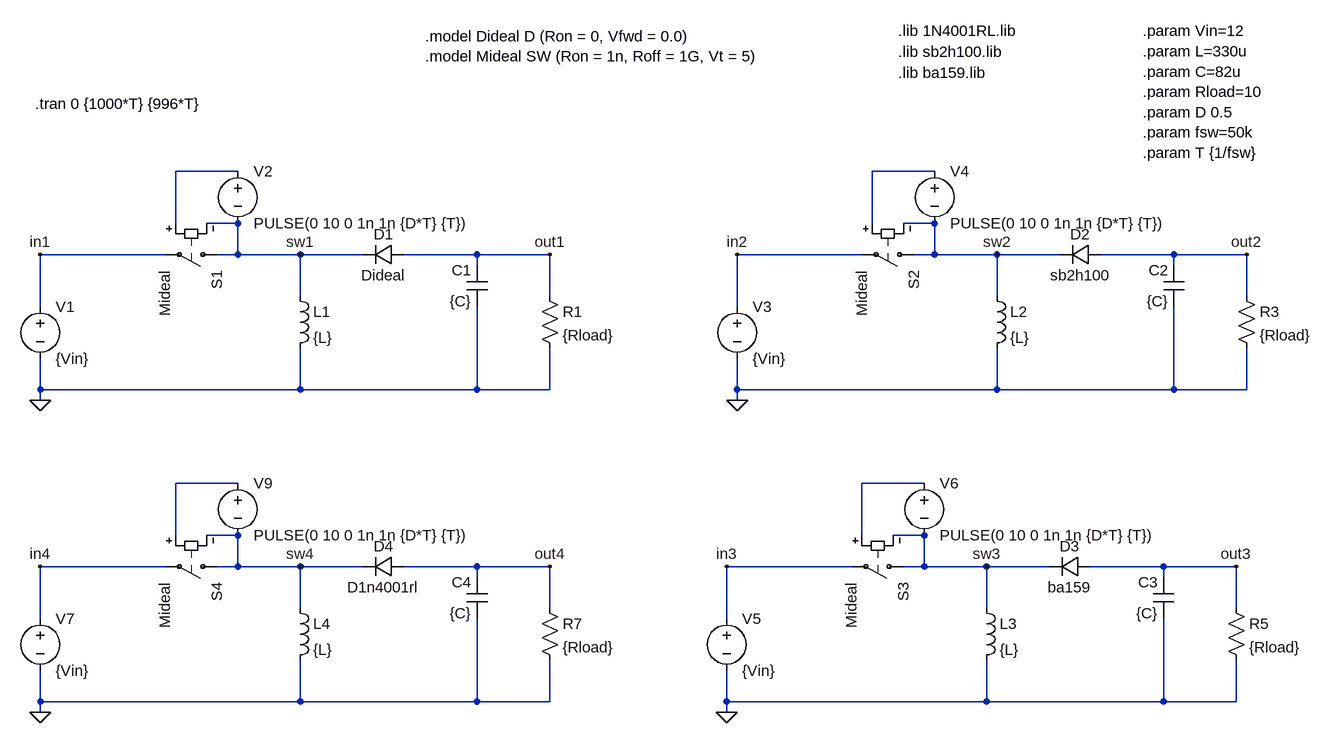
[diagram p0: schematic buckBoostRealDiode.asc]
buckBoostRealDiode.asc, the LTspice schematic file:
Version 4
SHEET 1 2852 1772
WIRE 320 -48 224 -48
WIRE 1392 -48 1296 -48
WIRE 224 32 224 -48
WIRE 320 32 272 32
WIRE 1296 32 1296 -48
WIRE 1392 32 1344 32
WIRE 208 80 16 80
WIRE 320 80 320 32
WIRE 320 80 288 80
WIRE 416 80 320 80
WIRE 512 80 416 80
WIRE 688 80 576 80
WIRE 800 80 688 80
WIRE 1280 80 1088 80
WIRE 1392 80 1392 32
WIRE 1392 80 1360 80
WIRE 1488 80 1392 80
WIRE 1584 80 1488 80
WIRE 1760 80 1648 80
WIRE 1872 80 1760 80
WIRE 688 96 688 80
WIRE 1760 96 1760 80
WIRE 416 144 416 80
WIRE 800 144 800 80
WIRE 1488 144 1488 80
WIRE 1872 144 1872 80
WIRE 16 160 16 80
WIRE 1088 160 1088 80
WIRE 16 288 16 240
WIRE 416 288 416 224
WIRE 416 288 16 288
WIRE 688 288 688 160
WIRE 688 288 416 288
WIRE 800 288 800 224
WIRE 800 288 688 288
WIRE 1088 288 1088 240
WIRE 1488 288 1488 224
WIRE 1488 288 1088 288
WIRE 1760 288 1760 160
WIRE 1760 288 1488 288
WIRE 1872 288 1872 224
WIRE 1872 288 1760 288
WIRE 16 304 16 288
WIRE 1088 304 1088 288
WIRE 320 432 224 432
WIRE 1376 432 1280 432
WIRE 224 512 224 432
WIRE 320 512 272 512
WIRE 1280 512 1280 432
WIRE 1376 512 1328 512
WIRE 208 560 16 560
WIRE 320 560 320 512
WIRE 320 560 288 560
WIRE 416 560 320 560
WIRE 512 560 416 560
WIRE 688 560 576 560
WIRE 800 560 688 560
WIRE 1264 560 1072 560
WIRE 1376 560 1376 512
WIRE 1376 560 1344 560
WIRE 1472 560 1376 560
WIRE 1568 560 1472 560
WIRE 1744 560 1632 560
WIRE 1856 560 1744 560
WIRE 688 576 688 560
WIRE 1744 576 1744 560
WIRE 416 624 416 560
WIRE 800 624 800 560
WIRE 1472 624 1472 560
WIRE 1856 624 1856 560
WIRE 16 640 16 560
WIRE 1072 640 1072 560
WIRE 16 768 16 720
WIRE 416 768 416 704
WIRE 416 768 16 768
WIRE 688 768 688 640
WIRE 688 768 416 768
WIRE 800 768 800 704
WIRE 800 768 688 768
WIRE 1072 768 1072 720
WIRE 1472 768 1472 704
WIRE 1472 768 1072 768
WIRE 1744 768 1744 640
WIRE 1744 768 1472 768
WIRE 1856 768 1856 704
WIRE 1856 768 1744 768
WIRE 16 784 16 768
WIRE 1072 784 1072 768
FLAG 16 304 0
FLAG 800 80 out1
FLAG 16 80 in1
FLAG 416 80 sw1
FLAG 1088 304 0
FLAG 1872 80 out2
FLAG 1088 80 in2
FLAG 1488 80 sw2
FLAG 1072 784 0
FLAG 1856 560 out3
FLAG 1072 560 in3
FLAG 1472 560 sw3
FLAG 16 784 0
FLAG 800 560 out4
FLAG 16 560 in4
FLAG 416 560 sw4
SYMBOL voltage 16 144 R0
WINDOW 123 0 0 Left 0
WINDOW 39 0 0 Left 0
SYMATTR InstName V1
SYMATTR Value {Vin}
SYMBOL res 784 128 R0
SYMATTR InstName R1
SYMATTR Value {Rload}
SYMBOL ind 400 128 R0
SYMATTR InstName L1
SYMATTR Value {L}
SYMBOL cap 704 160 R180
WINDOW 0 24 56 Left 2
WINDOW 3 24 8 Left 2
SYMATTR InstName C1
SYMATTR Value {C}
SYMBOL diode 576 64 R90
WINDOW 0 0 32 VBottom 2
WINDOW 3 32 32 VTop 2
SYMATTR InstName D1
SYMATTR Value Dideal
SYMBOL sw 304 80 R90
SYMATTR InstName S1
SYMATTR Value Mideal
SYMBOL voltage 320 -64 R0
WINDOW 123 0 0 Left 0
WINDOW 39 0 0 Left 0
SYMATTR InstName V2
SYMATTR Value PULSE(0 10 0 1n 1n {D*T} {T})
SYMBOL voltage 1088 144 R0
WINDOW 123 0 0 Left 0
WINDOW 39 0 0 Left 0
SYMATTR InstName V3
SYMATTR Value {Vin}
SYMBOL res 1856 128 R0
SYMATTR InstName R3
SYMATTR Value {Rload}
SYMBOL ind 1472 128 R0
SYMATTR InstName L2
SYMATTR Value {L}
SYMBOL cap 1776 160 R180
WINDOW 0 24 56 Left 2
WINDOW 3 24 8 Left 2
SYMATTR InstName C2
SYMATTR Value {C}
SYMBOL sw 1376 80 R90
SYMATTR InstName S2
SYMATTR Value Mideal
SYMBOL voltage 1392 -64 R0
WINDOW 123 0 0 Left 0
WINDOW 39 0 0 Left 0
SYMATTR InstName V4
SYMATTR Value PULSE(0 10 0 1n 1n {D*T} {T})
SYMBOL voltage 1072 624 R0
WINDOW 123 0 0 Left 0
WINDOW 39 0 0 Left 0
SYMATTR InstName V5
SYMATTR Value {Vin}
SYMBOL res 1840 608 R0
SYMATTR InstName R5
SYMATTR Value {Rload}
SYMBOL ind 1456 608 R0
SYMATTR InstName L3
SYMATTR Value {L}
SYMBOL cap 1760 640 R180
WINDOW 0 24 56 Left 2
WINDOW 3 24 8 Left 2
SYMATTR InstName C3
SYMATTR Value {C}
SYMBOL diode 1632 544 R90
WINDOW 0 0 32 VBottom 2
WINDOW 3 32 32 VTop 2
SYMATTR InstName D3
SYMATTR Value ba159
SYMBOL sw 1360 560 R90
SYMATTR InstName S3
SYMATTR Value Mideal
SYMBOL voltage 1376 416 R0
WINDOW 123 0 0 Left 0
WINDOW 39 0 0 Left 0
SYMATTR InstName V6
SYMATTR Value PULSE(0 10 0 1n 1n {D*T} {T})
SYMBOL voltage 16 624 R0
WINDOW 123 0 0 Left 0
WINDOW 39 0 0 Left 0
SYMATTR InstName V7
SYMATTR Value {Vin}
SYMBOL res 784 608 R0
SYMATTR InstName R7
SYMATTR Value {Rload}
SYMBOL ind 400 608 R0
SYMATTR InstName L4
SYMATTR Value {L}
SYMBOL cap 704 640 R180
WINDOW 0 24 56 Left 2
WINDOW 3 24 8 Left 2
SYMATTR InstName C4
SYMATTR Value {C}
SYMBOL diode 576 544 R90
WINDOW 0 0 32 VBottom 2
WINDOW 3 32 32 VTop 2
SYMATTR InstName D4
SYMATTR Value D1n4001rl
SYMBOL sw 304 560 R90
SYMATTR InstName S4
SYMATTR Value Mideal
SYMBOL voltage 320 416 R0
WINDOW 123 0 0 Left 0
WINDOW 39 0 0 Left 0
SYMATTR InstName V9
SYMATTR Value PULSE(0 10 0 1n 1n {D*T} {T})
SYMBOL diode 1648 64 R90
WINDOW 0 0 32 VBottom 2
WINDOW 3 32 32 VTop 2
SYMATTR InstName D2
SYMATTR Value sb2h100
SYMATTR Prefix X
TEXT 1712 -264 Left 2 !.param Vin=12 \n.param L=330u \n.param C=82u \n.param Rload=10 \n.param D 0.5\n.param fsw=50k\n.param T {1/fsw}
TEXT 8 -152 Left 2 !.tran 0 {1000*T} {996*T}
TEXT 608 -256 Left 2 !.model Dideal D (Ron = 0, Vfwd = 0.0)\n.model Mideal SW (Ron = 1n, Roff = 1G, Vt = 5)
TEXT 1336 -264 Left 2 !.lib 1N4001RL.lib
TEXT 1336 -232 Left 2 !.lib sb2h100.lib
TEXT 1336 -200 Left 2 !.lib ba159.lib

The netlist it stands for:
* buckBoostRealDiode.asc
V1 in1 0 {Vin}
R1 out1 0 {Rload}
L1 sw1 0 {L}
C1 0 out1 {C}
D1 out1 sw1 Dideal
S1 sw1 in1 N001 sw1 Mideal
V2 N001 sw1 PULSE(0 10 0 1n 1n {D*T} {T})
V3 in2 0 {Vin}
R3 out2 0 {Rload}
L2 sw2 0 {L}
C2 0 out2 {C}
S2 sw2 in2 N002 sw2 Mideal
V4 N002 sw2 PULSE(0 10 0 1n 1n {D*T} {T})
V5 in3 0 {Vin}
R5 out3 0 {Rload}
L3 sw3 0 {L}
C3 0 out3 {C}
D3 out3 sw3 ba159
S3 sw3 in3 N004 sw3 Mideal
V6 N004 sw3 PULSE(0 10 0 1n 1n {D*T} {T})
V7 in4 0 {Vin}
R7 out4 0 {Rload}
L4 sw4 0 {L}
C4 0 out4 {C}
D4 out4 sw4 D1n4001rl
S4 sw4 in4 N003 sw4 Mideal
V9 N003 sw4 PULSE(0 10 0 1n 1n {D*T} {T})
XD2 out2 sw2 sb2h100  ; pins + -
.model D D
.lib standard.dio
.param Vin=12
.param L=330u
.param C=82u
.param Rload=10
.param D 0.5
.param fsw=50k
.param T {1/fsw}
.tran 0 {1000*T} {996*T}
.model Dideal D (Ron = 0, Vfwd = 0.0)
.model Mideal SW (Ron = 1n, Roff = 1G, Vt = 5)
.lib 1N4001RL.lib
.lib sb2h100.lib
.lib ba159.lib
.backanno
.end